# Altium schematic sheet phy.SchDoc
size A3
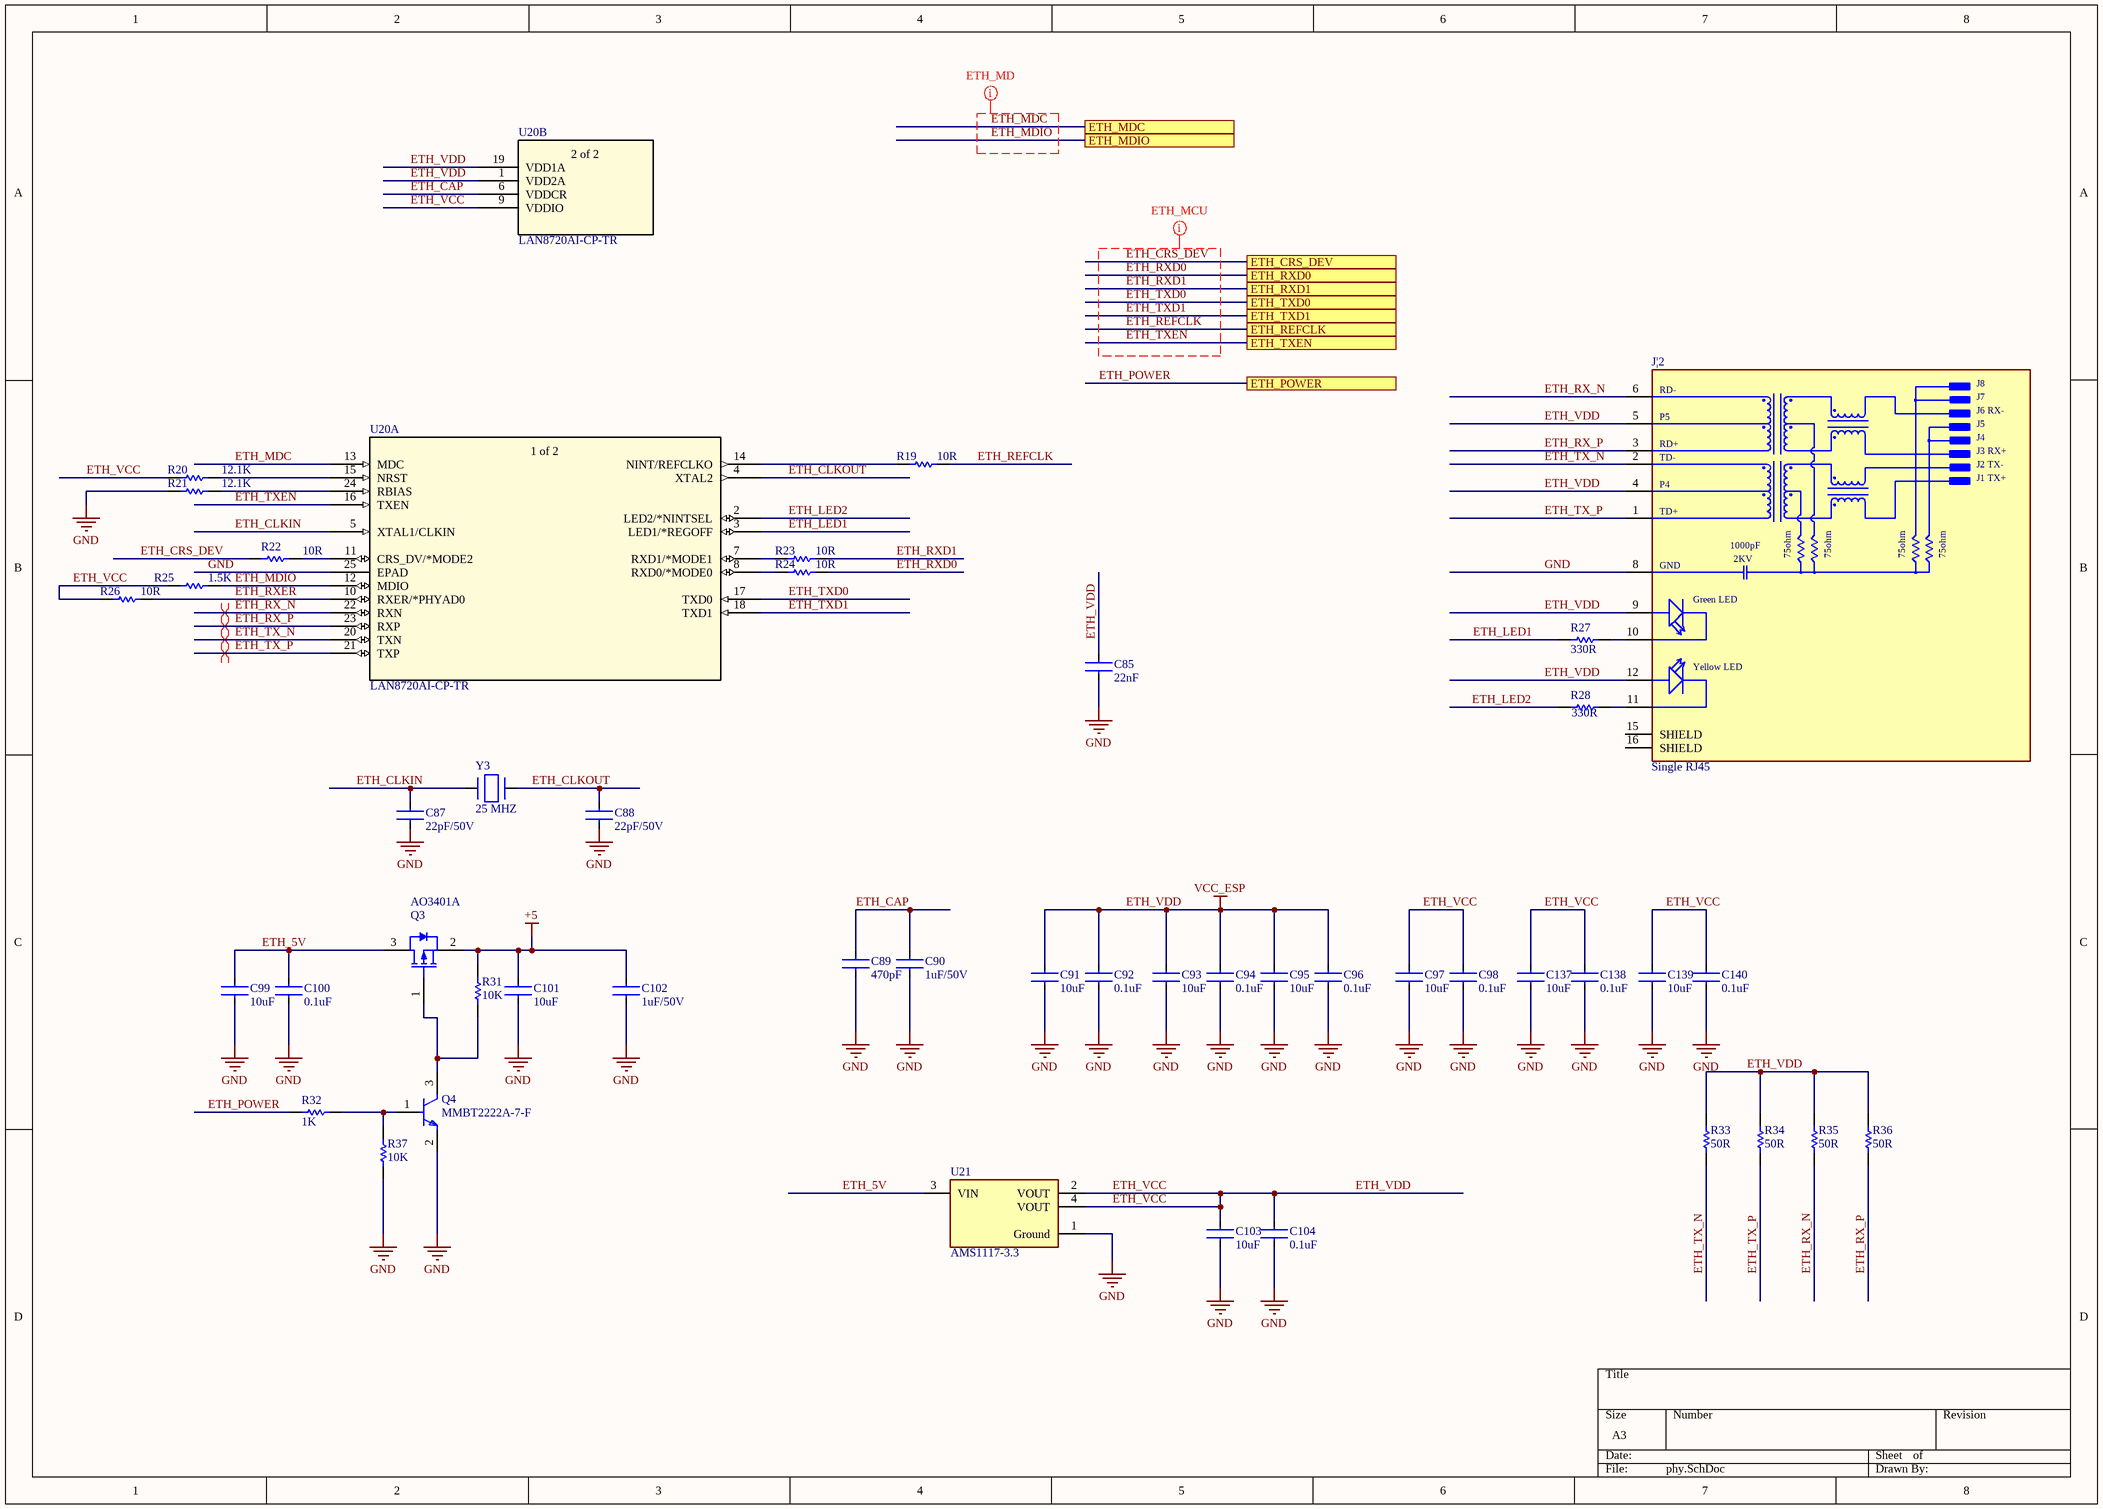
[diagram p0: phy.SchDoc]

## Parts
C85  22nF  [C0402]
C87  22pF/50V  [C0402]
C88  22pF/50V  [C0402]
C89  470pF  [C0402]
C90  1uF/50V  [C0402]
C91  10uF  [C0402]
C92  0.1uF  [C0402]
C93  10uF  [C0402]
C94  0.1uF  [C0402]
C95  10uF  [C0402]
C96  0.1uF  [C0402]
C97  10uF  [C0402]
C98  0.1uF  [C0402]
C99  10uF  [C0402]
C100  0.1uF  [C0402]
C101  10uF  [C0402]
C102  1uF/50V  [C0402]
C103  10uF  [C0402]
C104  0.1uF  [C0402]
C137  10uF  [C0402]
C138  0.1uF  [C0402]
C139  10uF  [C0402]
C140  0.1uF  [C0402]
J|2  Single RJ45  [HANRUN_HR911105A]
Q3  AO3401A  [SOT-23-3L_AOS]
Q4  MMBT2222A-7-F  [SOT-23-3L_AOS]
R19  10R  [R0402]
R20  12.1K  [R0402]
R21  12.1K  [R0402]
R22  10R  [R0402]
R23  10R  [R0402]
R24  10R  [R0402]
R25  1.5K  [R0402]
R26  10R  [R0402]
R27  330R  [R0402]
R28  330R  [R0402]
R31  10K  [R0402]
R32  1K  [R0402]
R33  50R  [R0402]
R34  50R  [R0402]
R35  50R  [R0402]
R36  50R  [R0402]
R37  10K  [R0402]
U20  LAN8720AI-CP-TR  [QFN24-6X6_MC_MCH]  (parts A,B of 2)
U21  AMS1117-3.3  [Advanced_Monolithic_Systems_AMS1117_IPC_A]
Y3  25 MHZ  [CTS_ATS080B_0]

## Ports
ETH_CRS_DEV, ETH_MDC, ETH_MDIO, ETH_POWER, ETH_REFCLK, ETH_RXD0, ETH_RXD1, ETH_TXD0, ETH_TXD1, ETH_TXEN

## Nets
+5: C101.1 C102.1 Q3.2(S) R31.2
ETH_VCC: C85.1 C91.1 C92.1 C93.1 C94.1 C95.1 C96.1 C97.1 C98.1 C103.1 C104.1 C137.1 C138.1 C139.1 C140.1 J|2.4(P4) J|2.5(P5) J|2.9(GA) J|2.12(YA) R20.1 R25.1 R26.1 R33.2 R34.2 R35.2 R36.2 U20.1(VDD2A) U20.9(VDDIO) U20.19(VDD1A) U21.2(VOUT) U21.4(VOUT)  [also labelled ETH_VDD, VCC_ESP]
GND: C85.2 C87.2 C88.2 C89.2 C90.2 C91.2 C92.2 C93.2 C94.2 C95.2 C96.2 C97.2 C98.2 C99.2 C100.2 C101.2 C102.2 C103.2 C104.2 C137.2 C138.2 C139.2 C140.2 J|2.8(GND) Q4.2(E) R21.1 R37.1 U20.25(EPAD) U21.1(Ground)
ETH_5V: C99.1 C100.1 Q3.3(D) U21.3(VIN)
ETH_CAP: C89.1 C90.1 U20.6(VDDCR)
ETH_CLKIN: C87.1 U20.5(XTAL1/CLKIN) Y3.1
ETH_CLKOUT: C88.1 U20.4(XTAL2) Y3.2
ETH_CRS_DEV: R22.1 ; port ETH_CRS_DEV
ETH_LED1: R27.2 U20.3(LED1/*REGOFF)
ETH_LED2: R28.1 U20.2(LED2/*NINTSEL)
ETH_MDC: U20.13(MDC) ; port ETH_MDC
ETH_MDIO: R25.2 U20.12(MDIO) ; port ETH_MDIO
ETH_POWER: R32.1 ; port ETH_POWER
ETH_REFCLK: R19.2 ; port ETH_REFCLK
ETH_RX_N: J|2.6(RD-) R35.1 U20.22(RXN)
ETH_RX_P: J|2.3(RD+) R36.1 U20.23(RXP)
ETH_RXD0: R24.2 ; port ETH_RXD0
ETH_RXD1: R23.2 ; port ETH_RXD1
ETH_RXER: R26.2 U20.10(RXER/*PHYAD0)
ETH_TX_N: J|2.2(TD-) R33.1 U20.20(TXN)
ETH_TX_P: J|2.1(TD+) R34.1 U20.21(TXP)
ETH_TXD0: U20.17(TXD0) ; port ETH_TXD0
ETH_TXD1: U20.18(TXD1) ; port ETH_TXD1
ETH_TXEN: U20.16(TXEN) ; port ETH_TXEN
NetJ|2_10: J|2.10(GC) R27.1
NetJ|2_11: J|2.11(YC) R28.2
NetQ3_1: Q3.1(G) Q4.3(C) R31.1
NetQ4_1: Q4.1(B) R32.2 R37.2
NetR19_1: R19.1 U20.14(NINT/REFCLKO)
NetR20_2: R20.2 U20.15(NRST)
NetR21_2: R21.2 U20.24(RBIAS)
NetR22_2: R22.2 U20.11(CRS_DV/*MODE2)
NetR23_1: R23.1 U20.7(RXD1/*MODE1)
NetR24_1: R24.1 U20.8(RXD0/*MODE0)

Not connected (* = marked no-connect by the designer): J|2 15(SHIELD) 16(SHIELD)

## Layout directives
differential pair; differential pair class ETH_RX: ETH_RX_N, ETH_RX_P
differential pair; differential pair class ETH_TX: ETH_TX_N, ETH_TX_P
rule Matched Net Lengths [Tolerance = 10mil]; net class ETH_CTL; rule Width Constraint [Pref Width = 8mil    Min Width = 8mil    Max Width = 8mil]: ETH_MDC, ETH_MDIO
net class ETH_IN; rule Matched Net Lengths [Tolerance = 10mil]; rule Width Constraint [Pref Width = 8mil    Min Width = 8mil    Max Width = 8mil]: ETH_CRS_DEV, ETH_REFCLK, ETH_RXD0, ETH_RXD1, ETH_TXD0, ETH_TXD1, ETH_TXEN

## Notes on the sheet
- (in symbol HR911105A) J8; J7; J6 RX-; J5; J4; J3 RX+; J2 TX-; J1 TX+; 1000pF; 75ohm; 2KV; Green LED; Yellow LED
- (in symbol LAN8720AI-CP-TR, part A) 1 of 2
- (in symbol LAN8720AI-CP-TR, part B) 2 of 2

## Library data of the parts
C85 = CL31B223KBCNNNC: Cap Ceramic 22nF 50V C0G 5% SMD 1206 125°C Paper T/R; Manufacturer: Samsung; Capacitance: 22pF; Temperature Coefficient: 300ppm/°C; Supplier 1: Arrow Electronics; Manufacturer Part Number: CL31B223KBCNNNC; RoHS: Yes; Category: Ceramic Capacitors; Stock 1: 470; Pricing 1: 1=0.13340, 10=0.08580, 25=0.08490, 100=0.04720, 250=0.04670 (USD); Mount: Surface Mount; Case/Package: 1206; Case Code (Metric): 3216; Case Code (Imperial): 1206; Material: Ceramic; Min Operating Temperature: -55°C; Max Operating Temperature: 125°C; Tolerance: 5%; Dielectric: C0G; Voltage Rating: 50V; Package Quantity: 1; Packaging: Tape and Reel; Voltage: 50V; Voltage Rating (DC): 50V; Series: CL; Construction: Flat; Length: 3.2mm; Width: 0.063inch; Height: 0.85mm; Depth: 1.6mm; Thickness: 0.039inch; Radiation Hardening: No; Lead Free: Lead Free; RoHS Compliant: Yes; ComponentLink1URL: https://datasheet.ciiva.com/25799/cl31c220jbcnnnc-25799089.pdf?src-supplier=Digi-Key; ComponentLink1Description: https://datasheet.ciiva.com/25799/cl31c220jbcnnnc-25799089.pdf?src-supplier=Digi-Key; ComponentLink2URL: https://datasheet.ciiva.com/29201/452314-da-01-en-vs-kondensator-1206-29201377.pdf?src-supplier=Conrad; ComponentLink2Description: https://datasheet.ciiva.com/29201/452314-da-01-en-vs-kondensator-1206-29201377.pdf?src-supplier=Conrad; Supplier Part Number 1: CL31C220JBCNNNC
C87 C88 = CL31C220JBCNNNC: Cap Ceramic 22pF 50V C0G 5% SMD 1206 125°C Paper T/R; Manufacturer: Samsung; Temperature Coefficient: 300ppm/°C; Supplier 1: Arrow Electronics; Manufacturer Part Number: CL31C220JBCNNNC; RoHS: Yes; Category: Ceramic Capacitors; Stock 1: 470; Pricing 1: 1=0.13340, 10=0.08580, 25=0.08490, 100=0.04720, 250=0.04670 (USD); Mount: Surface Mount; Case/Package: 1206; Case Code (Metric): 3216; Case Code (Imperial): 1206; Material: Ceramic; Min Operating Temperature: -55°C; Max Operating Temperature: 125°C; Capacitance: 22pF; Tolerance: 5%; Dielectric: C0G; Voltage Rating: 50V; Package Quantity: 1; Packaging: Tape and Reel; Voltage: 50V; Voltage Rating (DC): 50V; Series: CL; Construction: Flat; Length: 3.2mm; Width: 0.063inch; Height: 0.85mm; Depth: 1.6mm; Thickness: 0.039inch; Radiation Hardening: No; Lead Free: Lead Free; RoHS Compliant: Yes; ComponentLink1URL: https://datasheet.ciiva.com/25799/cl31c220jbcnnnc-25799089.pdf?src-supplier=Digi-Key; ComponentLink1Description: https://datasheet.ciiva.com/25799/cl31c220jbcnnnc-25799089.pdf?src-supplier=Digi-Key; ComponentLink2URL: https://datasheet.ciiva.com/29201/452314-da-01-en-vs-kondensator-1206-29201377.pdf?src-supplier=Conrad; ComponentLink2Description: https://datasheet.ciiva.com/29201/452314-da-01-en-vs-kondensator-1206-29201377.pdf?src-supplier=Conrad; Supplier Part Number 1: CL31C220JBCNNNC
C89 = CL31B471KBCNNNC: Cap Ceramic 470pF 50V C0G 5% SMD 1206 125°C Paper T/R; Manufacturer: Samsung; Manufacturer Part Number: CL31C220JBCNNNC; Capacitance: 22pF; Temperature Coefficient: 300ppm/°C; Supplier 1: Arrow Electronics; RoHS: Yes; Category: Ceramic Capacitors; Stock 1: 470; Pricing 1: 1=0.13340, 10=0.08580, 25=0.08490, 100=0.04720, 250=0.04670 (USD); Mount: Surface Mount; Case/Package: 1206; Case Code (Metric): 3216; Case Code (Imperial): 1206; Material: Ceramic; Min Operating Temperature: -55°C; Max Operating Temperature: 125°C; Tolerance: 5%; Dielectric: C0G; Voltage Rating: 50V; Package Quantity: 1; Packaging: Tape and Reel; Voltage: 50V; Voltage Rating (DC): 50V; Series: CL; Construction: Flat; Length: 3.2mm; Width: 0.063inch; Height: 0.85mm; Depth: 1.6mm; Thickness: 0.039inch; Radiation Hardening: No; Lead Free: Lead Free; RoHS Compliant: Yes; ComponentLink1URL: https://datasheet.ciiva.com/25799/cl31c220jbcnnnc-25799089.pdf?src-supplier=Digi-Key; ComponentLink1Description: https://datasheet.ciiva.com/25799/cl31c220jbcnnnc-25799089.pdf?src-supplier=Digi-Key; ComponentLink2URL: https://datasheet.ciiva.com/29201/452314-da-01-en-vs-kondensator-1206-29201377.pdf?src-supplier=Conrad; ComponentLink2Description: https://datasheet.ciiva.com/29201/452314-da-01-en-vs-kondensator-1206-29201377.pdf?src-supplier=Conrad; Supplier Part Number 1: CL31C220JBCNNNC
C90 C102 = CL31B105KBHNNNE: CAP CER 1UF 50V X7R 1206; Manufacturer: Samsung; Material: Ceramic; Tolerance: 10%; Supplier 1: Arrow Electronics; Manufacturer Part Number: CL31B105KBHNNNE; RoHS: Yes; Category: Ceramic Capacitors; Stock 1: 2628000; Pricing 1: 2000=0.02720, 4000=0.02450, 10000=0.02260 (USD); Mount: Surface Mount; Case/Package: 1206; Case Code (Metric): 3216; Case Code (Imperial): 1206; Contact Plating: Tin; Min Operating Temperature: -55°C; Max Operating Temperature: 125°C; Capacitance: 1uF; Dielectric: X7R; Voltage Rating: 50V; Packaging: Tape and Reel; Package Quantity: 1; Voltage: 50V; Voltage Rating (DC): 50V; Series: CL; Construction: Flat; Length: 3.2mm; Width: 0.063inch; Height: 1.6mm; Thickness: 0.071inch; Depth: 1.6mm; Radiation Hardening: No; Lead Free: Lead Free; RoHS Compliant: Yes; ComponentLink1URL: https://datasheet.ciiva.com/25729/cl31b105kbhnnne-25729445.pdf?src-supplier=Digi-Key; ComponentLink1Description: https://datasheet.ciiva.com/25729/cl31b105kbhnnne-25729445.pdf?src-supplier=Digi-Key; ComponentLink2URL: https://datasheet.ciiva.com/16330/cl31b105kbhnnne-16330112.pdf?src-supplier=Future+Electronics; ComponentLink2Description: https://datasheet.ciiva.com/16330/cl31b105kbhnnne-16330112.pdf?src-supplier=Future+Electronics; ComponentLink3URL: https://datasheet.ciiva.com/26838/getdatasheetpartid-357471-26838902.pdf?src-supplier=Verical; ComponentLink3Description: https://datasheet.ciiva.com/26838/getdatasheetpartid-357471-26838902.pdf?src-supplier=Verical; ComponentLink4URL: https://datasheet.ciiva.com/29200/453294-da-01-en-vs-kondensator-1206-29200453.pdf?src-supplier=Conrad; ComponentLink4Description: https://datasheet.ciiva.com/29200/453294-da-01-en-vs-kondensator-1206-29200453.pdf?src-supplier=Conrad; Supplier Part Number 1: CL31B105KBHNNNE
C91 C93 C95 C97 C99 C101 C103 C137 C139 = CL31B106KOHNNNE: Cap Ceramic 10uF 16V X7R 10% Pad SMD 1206 125°C T/R; Manufacturer: Samsung; Supplier 1: Future Electronics; Manufacturer Part Number: CL31B106KOHNNNE; RoHS: Yes; Category: Ceramic Capacitors; Stock 1: 116000; Pricing 1: 2000=0.03800, 6000=0.03460, 8000=0.03450, 20000=0.03420, 30000=0.03400 (USD); Mount: Surface Mount; Case/Package: 1206; Case Code (Metric): 3216; Case Code (Imperial): 1206; Material: Ceramic; Contact Plating: Tin; Min Operating Temperature: -55°C; Max Operating Temperature: 125°C; Capacitance: 10uF; Tolerance: 10%; Dielectric: X7R; Package Quantity: 1; Packaging: Tape and Reel; Voltage Rating: 16V; Series: CL; Length: 3.2mm; Width: 0.063inch; Height: 1.6mm; Thickness: 0.071inch; Depth: 1.6mm; RoHS Compliant: Yes; ComponentLink1URL: https://datasheet.ciiva.com/25795/cl31b106kohnnne-25795201.pdf?src-supplier=Digi-Key; ComponentLink1Description: https://datasheet.ciiva.com/25795/cl31b106kohnnne-25795201.pdf?src-supplier=Digi-Key; ComponentLink2URL: https://datasheet.ciiva.com/29201/452535-da-01-en-vs-kondensator-1206-29201132.pdf?src-supplier=Conrad; ComponentLink2Description: https://datasheet.ciiva.com/29201/452535-da-01-en-vs-kondensator-1206-29201132.pdf?src-supplier=Conrad; Supplier Part Number 1: 2558872
C92 C94 C96 C98 C100 C104 C138 C140 = CL31B104KBCNNNC: Ceramic capacitor SMD-1206 100nF /50V X7R# K +-10%, Samsung, RoHS; Tolerance: 10%; Dielectric: X7R; Voltage: 50V; Supplier 1: Arrow Electronics; Manufacturer: Samsung; Manufacturer Part Number: CL31B104KBCNNNC; RoHS: Yes; Category: Ceramic Capacitors; Stock 1: 3508000; Pricing 1: 4000=0.02060, 8000=0.01660 (USD); Mount: Surface Mount; Case/Package: 1206; Case Code (Metric): 3216; Case Code (Imperial): 1206; Material: Ceramic; Contact Plating: Tin; Min Operating Temperature: -55°C; Max Operating Temperature: 125°C; Capacitance: 100nF; Voltage Rating (DC): 50V; Packaging: Tape and Reel; Voltage Rating: 50V; Series: CL; Length: 3.2mm; Width: 0.063inch; Height: 0.85mm; Depth: 1.6mm; Thickness: 0.037inch; Radiation Hardening: No; Lead Free: Lead Free; RoHS Compliant: Yes; ComponentLink1URL: https://datasheet.ciiva.com/25710/cl31b104kbcnnnc-25710293.pdf?src-supplier=Digi-Key; ComponentLink1Description: https://datasheet.ciiva.com/25710/cl31b104kbcnnnc-25710293.pdf?src-supplier=Digi-Key; ComponentLink2URL: https://datasheet.ciiva.com/29201/451941-da-01-en-vs-kondensator-1206-29201689.pdf?src-supplier=Conrad; ComponentLink2Description: https://datasheet.ciiva.com/29201/451941-da-01-en-vs-kondensator-1206-29201689.pdf?src-supplier=Conrad; ComponentLink3URL: https://datasheet.ciiva.com/16298/cl05b104kq5nnnc-16298186.pdf?src-supplier=Future+Electronics; ComponentLink3Description: https://datasheet.ciiva.com/16298/cl05b104kq5nnnc-16298186.pdf?src-supplier=Future+Electronics; Supplier Part Number 1: CL31B104KBCNNNC
J|2 = HR911105A: HR911105A Ethernet Interface Arduino Platform Evaluation Expansion Board; MF: DFRobot; Package: None; Availability: Unavailable; MP: HR911105A; Value: *; SnapEDA_Link: https://www.snapeda.com/parts/HR911105A/DFRobot/view-part/214807/?ref=snap; Price: None
Q3 = AO3401A: No Description Available; Mfr_Name: Alpha and Omega Semiconductor; Type: DEV; Copyright: Copyright (C) 2022 Ultra Librarian. All rights reserved.; Manufacturer_Part_Number: AO3401A; RefDes: RefDes
Q4 = MMBT2222A-7-F: NPN Ic=600mA Vceo=40V hfe=100~300 fT=300MHz P=310mW SOT-23; Manufacturer: Diodes; hFE Min: 100; Frequency: 300MHz; Max Power Dissipation: 300mW; Number of Elements: 1; Collector Emitter Voltage (VCEO): 40V; Collector Base Voltage (VCBO): 75V; Emitter Base Voltage (VEBO): 6V; Collector Emitter Saturation Voltage: 1V; Max Collector Current: 600mA; Power Dissipation: 350mW; Element Configuration: Single; Current: 1A; Supplier 1: RSComponents; Manufacturer Part Number: MMBT2222A-7-F; RoHS: Yes; Category: BJTs; Stock 1: 3000; Pricing 1: 3000=0.02700, 6000=0.02500, 12000=0.02400, 30000=0.02300, 60000=0.02100 (USD); Mount: Surface Mount; Case/Package: SOT-23; Number of Pins: 3; Weight: 0.000282oz; Contact Plating: Tin,Matte; Min Operating Temperature: -55°C; Max Operating Temperature: 150°C; Polarity: NPN; Packaging: Tape and Reel; Package Quantity: 3000; Continuous Collector Current: 600mA; Collector Emitter Breakdown Voltage: 40V; Transition Frequency: 300MHz; Max Breakdown Voltage: 40V; Max Frequency: 300MHz; Termination: SMD/SMT; Gain Bandwidth Product: 300MHz; Voltage Rating (DC): 40V; Current Rating: 600mA; Voltage: 40V; Collector-emitter Voltage-Max: 1V; Series: -; Length: 3.05mm; Width: 1.4mm; Height: 1mm; Radiation Hardening: No; REACH SVHC: No SVHC; Lead Free: Lead Free; RoHS Compliant: Yes; ComponentLink1URL: https://datasheet.ciiva.com/15139/getdatasheetpartid-82692-15139078.pdf?src-supplier=Verical; ComponentLink1Description: https://datasheet.ciiva.com/15139/getdatasheetpartid-82692-15139078.pdf?src-supplier=Verical; ComponentLink2URL: https://datasheet.ciiva.com/8029/ds30041-8029709.pdf?src-supplier=Element14; ComponentLink2Description: https://datasheet.ciiva.com/8029/ds30041-8029709.pdf?src-supplier=Element14; ComponentLink3URL: https://datasheet.ciiva.com/11201/ds30041-11201864.pdf?src-supplier=Avnet; ComponentLink3Description: https://datasheet.ciiva.com/11201/ds30041-11201864.pdf?src-supplier=Avnet; ComponentLink4URL: https://datasheet.ciiva.com/16199/ds30041-16199045.pdf?src-supplier=Future+Electronics; ComponentLink4Description: https://datasheet.ciiva.com/16199/ds30041-16199045.pdf?src-supplier=Future+Electronics; ComponentLink5URL: https://datasheet.ciiva.com/11198/ds30041-11198965.pdf?src-supplier=Avnet; ComponentLink5Description: https://datasheet.ciiva.com/11198/ds30041-11198965.pdf?src-supplier=Avnet; ComponentLink6URL: https://datasheet.ciiva.com/972/ds30041-972551.pdf?src-supplier=Digi-Key; ComponentLink6Description: https://datasheet.ciiva.com/972/ds30041-972551.pdf?src-supplier=Digi-Key; ComponentLink7URL: https://datasheet.ciiva.com/972/ds30041-972552.pdf?src-supplier=Digi-Key; ComponentLink7Description: https://datasheet.ciiva.com/972/ds30041-972552.pdf?src-supplier=Digi-Key; ComponentLink8URL: https://datasheet.ciiva.com/972/ds30041-972550.pdf?src-supplier=Digi-Key; ComponentLink8Description: https://datasheet.ciiva.com/972/ds30041-972550.pdf?src-supplier=Digi-Key; Supplier Part Number 1: 1219442
R19 R22-R24 R26 = RC1206FR-0710RL: Res Thick Film 1206 10 Ohm 1% 0.25W(1/4W) +/-200ppm/ßC Epoxy SMD T/R; Manufacturer: Yageo; Temperature Coefficient: 200ppm/°C; Voltage Rating (DC): 200V; Power Rating: 250mW; Supplier 1: Arrow Electronics; Manufacturer Part Number: RC1206FR-0710RL; RoHS: Yes; Category: Chip SMD Resistors; Stock 1: 60000; Pricing 1: 5000=0.02280 (USD); Case/Package: 1206; Number of Pins: 2; Case Code (Metric): 3216; Case Code (Imperial): 1206; Size Code: 1206; Min Operating Temperature: -55°C; Max Operating Temperature: 155°C; Tolerance: 1%; Resistance: 10R; Resistor Type: Thick Film; Packaging: Tape and Reel; Package Quantity: 1; Voltage Rating: 200V; Number of Terminations: 2; Termination: SMD/SMT; Max Power Dissipation: 250mW; Features: Moisture Resistant; Series: RC; Resistance Tolerance: 1%; Technology: THICK FILM; Construction: Rectangular; Length: 3.1mm; Width: 0.063inch; Height: 0.026inch; Depth: 1.6mm; REACH SVHC: Unknown; Lead Free: Lead Free; Military Standard: Not; RoHS Compliant: Yes; ComponentLink1URL: https://datasheet.ciiva.com/11819/0900766b80c6630a-11819896.pdf?src-supplier=RSComponents; ComponentLink1Description: https://datasheet.ciiva.com/11819/0900766b80c6630a-11819896.pdf?src-supplier=RSComponents; ComponentLink2URL: https://datasheet.ciiva.com/22735/444357-22735648.pdf?src-supplier=Farnell; ComponentLink2Description: https://datasheet.ciiva.com/22735/444357-22735648.pdf?src-supplier=Farnell; ComponentLink3URL: https://datasheet.ciiva.com/29181/402303-da-01-en-smd-widerstand-chip1206-10-ohm-29181572.pdf?src-supplier=Conrad; ComponentLink3Description: https://datasheet.ciiva.com/29181/402303-da-01-en-smd-widerstand-chip1206-10-ohm-29181572.pdf?src-supplier=Conrad; ComponentLink4URL: https://datasheet.ciiva.com/46445/444357-46445704.pdf?src-supplier=Element14; ComponentLink4Description: https://datasheet.ciiva.com/46445/444357-46445704.pdf?src-supplier=Element14; ComponentLink5URL: https://datasheet.ciiva.com/2460/pyu-rc1206-51-rohs-l-4-2460049.pdf?src-supplier=Digi-Key; ComponentLink5Description: https://datasheet.ciiva.com/2460/pyu-rc1206-51-rohs-l-4-2460049.pdf?src-supplier=Digi-Key; ComponentLink6URL: https://datasheet.ciiva.com/2460/pyu-rc1206-51-rohs-l-4-2460050.pdf?src-supplier=Digi-Key; ComponentLink6Description: https://datasheet.ciiva.com/2460/pyu-rc1206-51-rohs-l-4-2460050.pdf?src-supplier=Digi-Key; ComponentLink7URL: https://datasheet.ciiva.com/2460/pyu-rc1206-51-rohs-l-4-2460048.pdf?src-supplier=Digi-Key; ComponentLink7Description: https://datasheet.ciiva.com/2460/pyu-rc1206-51-rohs-l-4-2460048.pdf?src-supplier=Digi-Key; ComponentLink8URL: https://datasheet.ciiva.com/16962/pyu-rc1206-51-rohs-l-4-16962857.pdf?src-supplier=Future+Electronics; ComponentLink8Description: https://datasheet.ciiva.com/16962/pyu-rc1206-51-rohs-l-4-16962857.pdf?src-supplier=Future+Electronics; Supplier Part Number 1: RC1206FR-0710RL
R20 R21 = RC1206FR-0712K1L: Res Thick Film 1206 12.1K Ohm 1% 0.25W(1/4W) ±100ppm/C Pad SMD T/R /; Manufacturer: Yageo; Manufacturer Part Number: RC1206FR-072K2L; Resistance: 2.2kR; Power Rating: 250mW; Temperature Coefficient: 100ppm/°C; Voltage Rating: 200V; Supplier 1: Arrow Electronics; RoHS: Yes; Category: Chip SMD Resistors; Stock 1: 20000; Pricing 1: 5000=0.01010 (USD); Case/Package: 1206; Case Code (Metric): 3216; Case Code (Imperial): 1206; Weight: 0.000571oz; Size Code: 1206; Min Operating Temperature: -55°C; Max Operating Temperature: 155°C; Tolerance: 1%; Packaging: Tape and Reel; Package Quantity: 1; Resistor Type: Thick Film; Number of Terminations: 2; Termination: SMD/SMT; Max Power Dissipation: 250mW; Features: Moisture Resistant; Series: RC; Resistance Tolerance: 1%; Construction: Rectangular; Length: 3.2mm; Width: 1.6mm; Height: 0.55mm; Depth: 1.6mm; REACH SVHC: Unknown; Lead Free: Lead Free; Military Standard: Not; RoHS Compliant: Yes; ComponentLink1URL: https://datasheet.ciiva.com/2461/pyu-rc1206-51-rohs-l-4-2461489.pdf?src-supplier=Digi-Key; ComponentLink1Description: https://datasheet.ciiva.com/2461/pyu-rc1206-51-rohs-l-4-2461489.pdf?src-supplier=Digi-Key; ComponentLink2URL: https://datasheet.ciiva.com/2461/pyu-rc1206-51-rohs-l-4-2461490.pdf?src-supplier=Digi-Key; ComponentLink2Description: https://datasheet.ciiva.com/2461/pyu-rc1206-51-rohs-l-4-2461490.pdf?src-supplier=Digi-Key; ComponentLink3URL: https://datasheet.ciiva.com/2461/pyu-rc1206-51-rohs-l-4-2461488.pdf?src-supplier=Digi-Key; ComponentLink3Description: https://datasheet.ciiva.com/2461/pyu-rc1206-51-rohs-l-4-2461488.pdf?src-supplier=Digi-Key; ComponentLink4URL: https://datasheet.ciiva.com/16978/pyu-rc1206-51-rohs-l-4-16978023.pdf?src-supplier=Future+Electronics; ComponentLink4Description: https://datasheet.ciiva.com/16978/pyu-rc1206-51-rohs-l-4-16978023.pdf?src-supplier=Future+Electronics; Supplier Part Number 1: RC1206FR-072K2L
R25 = RC1206FR-071K5L: In a Pack of 5000, 1.5K 1206 Thick Film SMD Resistor ±1% 0.25W - RC1206FR-071KL; Manufacturer: Yageo; Resistance: 1kR; Power Rating: 250mW; Voltage Rating: 200V; Temperature Coefficient: 100ppm/°C; Supplier 1: Arrow Electronics; Manufacturer Part Number: RC1206FR-071KL; RoHS: Yes; Category: Chip SMD Resistors; Stock 1: 535000; Pricing 1: 5000=0.00940, 10000=0.00890 (USD); Case/Package: 1206; Case Code (Imperial): 1206; Case Code (Metric): 3216; Size Code: 1206; Min Operating Temperature: -55°C; Max Operating Temperature: 155°C; Tolerance: 1%; Packaging: Tape and Reel; Resistor Type: Thick Film; Termination: SMD/SMT; Series: RC; Resistance Tolerance: 1%; Construction: Rectangular; Technology: THICK FILM; Length: 3.1mm; Height: 0.55mm; Depth: 1.6mm; REACH SVHC: Unknown; Military Standard: Not; Lead Free: Lead Free; RoHS Compliant: Yes; ComponentLink1URL: https://datasheet.ciiva.com/11808/0900766b80c6630a-11808217.pdf?src-supplier=RSComponents; ComponentLink1Description: https://datasheet.ciiva.com/11808/0900766b80c6630a-11808217.pdf?src-supplier=RSComponents; ComponentLink2URL: https://datasheet.ciiva.com/29181/402540-da-01-en-smd-widerstand-chip1206-1-kohm-29181462.pdf?src-supplier=Conrad; ComponentLink2Description: https://datasheet.ciiva.com/29181/402540-da-01-en-smd-widerstand-chip1206-1-kohm-29181462.pdf?src-supplier=Conrad; ComponentLink3URL: https://datasheet.ciiva.com/46445/444357-46445708.pdf?src-supplier=Element14; ComponentLink3Description: https://datasheet.ciiva.com/46445/444357-46445708.pdf?src-supplier=Element14; Supplier Part Number 1: RC1206FR-071KL
R27 R28 = RC1206FR-07330RL: Res Thick Film 1206 330 Ohm 1% 0.25W(1/4W) ±100ppm/°C Pad SMD T/R; Manufacturer: Yageo; Power Rating: 250mW; Voltage Rating: 200V; Supplier 1: Arrow Electronics; Manufacturer Part Number: RC1206FR-07330RL; RoHS: Yes; Category: Chip SMD Resistors; Stock 1: 4745; Pricing 1: 1=0.07520, 10=0.04740, 25=0.04700, 100=0.02480, 250=0.02450, 500=0.02430, 1000=0.02280, 3000=0.01110 (USD); Case/Package: 1206; Case Code (Imperial): 1206; Case Code (Metric): 3216; Size Code: 1206; Min Operating Temperature: -55°C; Max Operating Temperature: 155°C; Tolerance: 1%; Resistance: 330R; Resistor Type: Thick Film; Packaging: Tape and Reel; Termination: SMD/SMT; Temperature Coefficient: 100ppm/°C; Features: Moisture Resistant; Series: RC; Max Power Dissipation: 250mW; Number of Terminations: 2; Technology: THICK FILM; Resistance Tolerance: 1%; Length: 3.1mm; Height: 0.55mm; Depth: 1.6mm; RoHS Compliant: Yes; REACH SVHC: Unknown; Lead Free: Lead Free; ComponentLink1URL: https://datasheet.ciiva.com/11819/0900766b80c6630a-11819921.pdf?src-supplier=RSComponents; ComponentLink1Description: https://datasheet.ciiva.com/11819/0900766b80c6630a-11819921.pdf?src-supplier=RSComponents; ComponentLink2URL: https://datasheet.ciiva.com/17422/pyu-rc1206-51-rohs-l-4-17422588.pdf?src-supplier=Future+Electronics; ComponentLink2Description: https://datasheet.ciiva.com/17422/pyu-rc1206-51-rohs-l-4-17422588.pdf?src-supplier=Future+Electronics; Supplier Part Number 1: RC1206FR-07330RL
R31 R37 = RC1206FR-0710KL: Res Thick Film 1206 10K Ohm 1% 0.25W(1/4W) ±100ppm/C Pad SMD T/R; Manufacturer: Yageo; Resistance: 10kR; Temperature Coefficient: 100ppm/°C; Power Rating: 250mW; Voltage Rating: 200V; Supplier 1: Arrow Electronics; Manufacturer Part Number: RC1206FR-0710KL; RoHS: Yes; Category: Chip SMD Resistors; Stock 1: 10000; Pricing 1: 5000=0.00970 (USD); Case/Package: 1206; Case Code (Imperial): 1206; Case Code (Metric): 3216; Size Code: 1206; Min Operating Temperature: -55°C; Max Operating Temperature: 155°C; Tolerance: 1%; Packaging: Tape and Reel; Resistor Type: Thick Film; Package Quantity: 5000; Termination: SMD/SMT; Features: Moisture Resistant; Series: RC; Max Power Dissipation: 250mW; Number of Terminations: 2; Resistance Tolerance: 1%; Construction: Rectangular; Length: 3.1mm; Width: 1.6mm; Height: 0.55mm; Depth: 1.6mm; REACH SVHC: Unknown; Lead Free: Lead Free; Military Standard: Not; RoHS Compliant: Yes; ComponentLink1URL: https://datasheet.ciiva.com/46445/444357-46445703.pdf?src-supplier=Element14; ComponentLink1Description: https://datasheet.ciiva.com/46445/444357-46445703.pdf?src-supplier=Element14; ComponentLink2URL: https://datasheet.ciiva.com/7857/1692832-7857244.pdf?src-supplier=Element14; ComponentLink2Description: https://datasheet.ciiva.com/7857/1692832-7857244.pdf?src-supplier=Element14; ComponentLink3URL: https://datasheet.ciiva.com/7857/1692832-7857245.pdf?src-supplier=Element14; ComponentLink3Description: https://datasheet.ciiva.com/7857/1692832-7857245.pdf?src-supplier=Element14; Supplier Part Number 1: RC1206FR-0710KL
R32 = RC1206FR-071KL: In a Pack of 5000, 1K 1206 Thick Film SMD Resistor ±1% 0.25W - RC1206FR-071KL; Manufacturer: Yageo; Resistance: 1kR; Power Rating: 250mW; Voltage Rating: 200V; Temperature Coefficient: 100ppm/°C; Supplier 1: Arrow Electronics; Manufacturer Part Number: RC1206FR-071KL; RoHS: Yes; Category: Chip SMD Resistors; Stock 1: 535000; Pricing 1: 5000=0.00940, 10000=0.00890 (USD); Case/Package: 1206; Case Code (Imperial): 1206; Case Code (Metric): 3216; Size Code: 1206; Min Operating Temperature: -55°C; Max Operating Temperature: 155°C; Tolerance: 1%; Packaging: Tape and Reel; Resistor Type: Thick Film; Termination: SMD/SMT; Series: RC; Resistance Tolerance: 1%; Construction: Rectangular; Technology: THICK FILM; Length: 3.1mm; Height: 0.55mm; Depth: 1.6mm; REACH SVHC: Unknown; Military Standard: Not; Lead Free: Lead Free; RoHS Compliant: Yes; ComponentLink1URL: https://datasheet.ciiva.com/11808/0900766b80c6630a-11808217.pdf?src-supplier=RSComponents; ComponentLink1Description: https://datasheet.ciiva.com/11808/0900766b80c6630a-11808217.pdf?src-supplier=RSComponents; ComponentLink2URL: https://datasheet.ciiva.com/29181/402540-da-01-en-smd-widerstand-chip1206-1-kohm-29181462.pdf?src-supplier=Conrad; ComponentLink2Description: https://datasheet.ciiva.com/29181/402540-da-01-en-smd-widerstand-chip1206-1-kohm-29181462.pdf?src-supplier=Conrad; ComponentLink3URL: https://datasheet.ciiva.com/46445/444357-46445708.pdf?src-supplier=Element14; ComponentLink3Description: https://datasheet.ciiva.com/46445/444357-46445708.pdf?src-supplier=Element14; Supplier Part Number 1: RC1206FR-071KL
R33-R36 = RC1206FR-0750RL: Res Thick Film 1206 50 Ohm 1% 0.25W(1/4W) +/-200ppm/ßC Epoxy SMD T/R; Manufacturer: Yageo; Manufacturer Part Number: RC1206FR-0710RL; Resistance: 10R; Temperature Coefficient: 200ppm/°C; Voltage Rating (DC): 200V; Power Rating: 250mW; Supplier 1: Arrow Electronics; RoHS: Yes; Category: Chip SMD Resistors; Stock 1: 60000; Pricing 1: 5000=0.02280 (USD); Case/Package: 1206; Number of Pins: 2; Case Code (Metric): 3216; Case Code (Imperial): 1206; Size Code: 1206; Min Operating Temperature: -55°C; Max Operating Temperature: 155°C; Tolerance: 1%; Resistor Type: Thick Film; Packaging: Tape and Reel; Package Quantity: 1; Voltage Rating: 200V; Number of Terminations: 2; Termination: SMD/SMT; Max Power Dissipation: 250mW; Features: Moisture Resistant; Series: RC; Resistance Tolerance: 1%; Technology: THICK FILM; Construction: Rectangular; Length: 3.1mm; Width: 0.063inch; Height: 0.026inch; Depth: 1.6mm; REACH SVHC: Unknown; Lead Free: Lead Free; Military Standard: Not; RoHS Compliant: Yes; ComponentLink1URL: https://datasheet.ciiva.com/11819/0900766b80c6630a-11819896.pdf?src-supplier=RSComponents; ComponentLink1Description: https://datasheet.ciiva.com/11819/0900766b80c6630a-11819896.pdf?src-supplier=RSComponents; ComponentLink2URL: https://datasheet.ciiva.com/22735/444357-22735648.pdf?src-supplier=Farnell; ComponentLink2Description: https://datasheet.ciiva.com/22735/444357-22735648.pdf?src-supplier=Farnell; ComponentLink3URL: https://datasheet.ciiva.com/29181/402303-da-01-en-smd-widerstand-chip1206-10-ohm-29181572.pdf?src-supplier=Conrad; ComponentLink3Description: https://datasheet.ciiva.com/29181/402303-da-01-en-smd-widerstand-chip1206-10-ohm-29181572.pdf?src-supplier=Conrad; ComponentLink4URL: https://datasheet.ciiva.com/46445/444357-46445704.pdf?src-supplier=Element14; ComponentLink4Description: https://datasheet.ciiva.com/46445/444357-46445704.pdf?src-supplier=Element14; ComponentLink5URL: https://datasheet.ciiva.com/2460/pyu-rc1206-51-rohs-l-4-2460049.pdf?src-supplier=Digi-Key; ComponentLink5Description: https://datasheet.ciiva.com/2460/pyu-rc1206-51-rohs-l-4-2460049.pdf?src-supplier=Digi-Key; ComponentLink6URL: https://datasheet.ciiva.com/2460/pyu-rc1206-51-rohs-l-4-2460050.pdf?src-supplier=Digi-Key; ComponentLink6Description: https://datasheet.ciiva.com/2460/pyu-rc1206-51-rohs-l-4-2460050.pdf?src-supplier=Digi-Key; ComponentLink7URL: https://datasheet.ciiva.com/2460/pyu-rc1206-51-rohs-l-4-2460048.pdf?src-supplier=Digi-Key; ComponentLink7Description: https://datasheet.ciiva.com/2460/pyu-rc1206-51-rohs-l-4-2460048.pdf?src-supplier=Digi-Key; ComponentLink8URL: https://datasheet.ciiva.com/16962/pyu-rc1206-51-rohs-l-4-16962857.pdf?src-supplier=Future+Electronics; ComponentLink8Description: https://datasheet.ciiva.com/16962/pyu-rc1206-51-rohs-l-4-16962857.pdf?src-supplier=Future+Electronics; Supplier Part Number 1: RC1206FR-0710RL
U20 = LAN8720AI-CP-TR: No Description Available; Mfr_Name: Microchip; Copyright: Copyright (C) 2022 Ultra Librarian. All rights reserved.; Manufacturer_Part_Number: LAN8720AI-CP-TR; RefDes: RefDes; Type: DEV
U21 = AMS1117-3.3: Fixed 15V 3.3V 1.3V @ 800mA SOT-223 Dropout Regulators(LDO) RoHS
Y3 = CRYSTAL 25.000MHZ: CRYSTAL 25.000MHZ 20PF THRU; Manufacturer: TXC; Manufacturer Part Number: 9B-8.000MBBK-B; Frequency Stability: 50ppm; Frequency: 8MHz; ESR (Equivalent Series Resistance): 80R; Supplier 1: Digi-Key; RoHS: Yes; Category: Crystals; Pricing 1: 1000=0.16000 (USD); Mount: Through Hole; Case/Package: Metal; Min Operating Temperature: -20°C; Max Operating Temperature: 70°C; Package Quantity: 1000; Frequency Tolerance: 50ppm; Load Capacitance: 20pF; Packaging: Bulk; Length: 0.453inch; Width: 0.197inch; Height: 0.145inch; ComponentLink1URL: https://datasheet.ciiva.com/6733/9b-6733750.pdf?src-supplier=Digi-Key; ComponentLink1Description: https://datasheet.ciiva.com/6733/9b-6733750.pdf?src-supplier=Digi-Key; ComponentLink2URL: https://datasheet.ciiva.com/29631/9b-29631174.pdf?src-supplier=Digi-Key; ComponentLink2Description: https://datasheet.ciiva.com/29631/9b-29631174.pdf?src-supplier=Digi-Key; Supplier Part Number 1: 887-2033-ND